# Altium project Graduate Work.PrjPcb
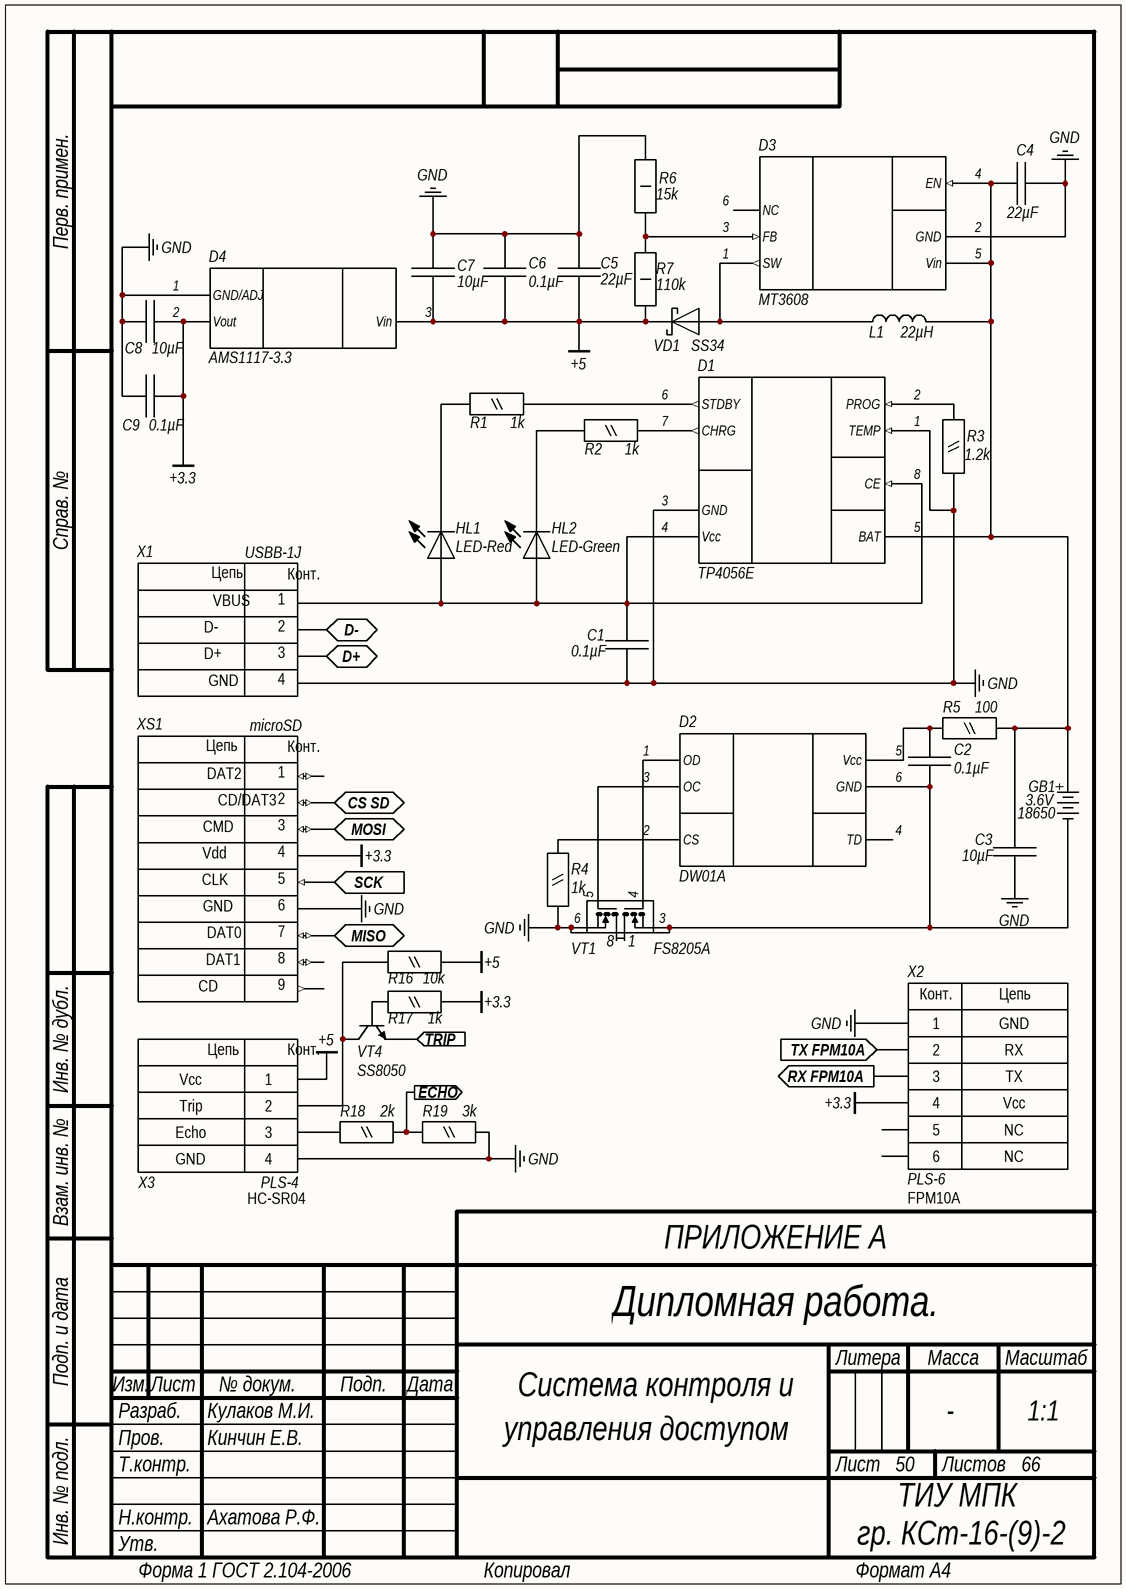
[diagram p0: Sheet1.SchDoc]

6 sheets, 88 parts. Net scope: flat (ports and power ports of the same name join across sheets).
Board file: PCB.PcbDoc
Sheets:
  Sheet1.SchDoc
  Sheet2.SchDoc
  Sheet3.SchDoc
  Sheet4.SchDoc
  Sheet5.SchDoc
  Sheet6.SchDoc

## Sheet Sheet1.SchDoc: =GlobalProjectName
size 209 x 297 mm; CheckedBy: Кинчин Е.В.; Author: Кулаков М.И.; DrawnBy: Кулаков М.; SheetNumber: 50; SheetTotal: 66; PageSetup: Record=PageOptions|CenterHorizontal=True|CenterVertical=True|PrintScale=1.00|XCorrection=1.00|YCorrection=1.00|PrintKind=1|BorderSize=5000000|LeftOffset=0|BottomOffset=0|Orientation=2|PaperLength=1000|PaperWidth=1000|Scale=100|PaperSource=15|PrintQuality=1200|MediaType=1|DitherType=10|PaperKind=A3|PrintScaleMode=1; Weight: -; ScaleFactor: 1:1; NormInspection: Ахатова Р.Ф.

### Parts
D1  TP4056E  [U SOIC-8]
D2  DW01A  [U SOT-23-6]
D3  MT3608  [U SOT-23-6]
D4  AMS1117-3.3  [U SOT-223]
GB1  3.6V  Case: 18650  [GB 18650]
HL1  LED-Red  [HL LED SMD 0805]
HL2  LED-Green  [HL LED SMD 0805]
L1  22µH  [L SMD D10]
R1  1k  [R SMD 0805]
R2  1k  [R SMD 0805]
R3  1.2k  [R SMD 0805]
R4  1k  [R SMD 0805]
R5  100  [R SMD 0805]
R6  15k  [R SMD 2512]
R7  110k  [R SMD 2512]
R16  10k  [R SMD 0805]
R17  1k  [R SMD 0805]
R18  2k  [R SMD 0805]
R19  3k  [R SMD 0805]
VD1  SS34  [VD DO-214AB]
VT1  FS8205A  [U TSSOP-8]
VT4  SS8050  [U SOT-23-3]
X1  USBB-1J  [X USBB-1J]
X2  PLS-6  CommentText: FPM10A  [X PLS-6]
X3  PLS-4  CommentText: HC-SR04  [X PLS-4]
XS1  microSD  [X microSD]
С1  0.1µF  [C SMD 0805]
С2  0.1µF  [C SMD 0805]
С3  10µF  [C SMD 0805]
С4  22µF  [C SMD 1206]
С5  22µF  [C SMD 1206]
С6  0.1µF  [C SMD 0805]
С7  10µF  [C SMD 0805]
С8  10µF  [C SMD 0805]
С9  0.1µF  [C SMD 0805]

### Ports
CS SD (bidir), D+ (bidir), D- (bidir), ECHO (out), MISO (bidir), MOSI (bidir), RX FPM10A (out), SCK (in), TRIP (in), TX FPM10A (in)

### Nets
+3.3: D4.2(Vout) R17.2 X2.4 XS1.4(Vdd) С8.2 С9.1
+5: D4.3(Vin) R7.2 R16.2 VD1.2 X3.1 С5.1 С6.1 С7.2
GND: D1.1(TEMP) D1.3(GND) D3.2(GND) D4.1(GND/ADJ) R3.1 R4.1 R6.2 R19.1 VT1.6(S2) VT1.7(S2) X1.4(GND) X2.1 X3.4 XS1.6(GND) С1.2 С3.2 С4.2 С5.2 С6.2 С7.1 С8.1 С9.2
NetD1_2: D1.2(PROG) R3.2
NetD1_4: D1.4(Vcc) D1.8(CE) HL1.1 HL2.1 X1.1(VBUS) С1.1
NetD1_5: D1.5(BAT) D3.4(EN) D3.5(Vin) GB1.2(+) L1.2 R5.2 С3.1 С4.1
NetD1_6: D1.6(STDBY) R1.2
NetD1_7: D1.7(CHRG) R2.2
NetD2_1: D2.1(OD) VT1.4(G1)
NetD2_2: D2.2(CS) R4.2
NetD2_3: D2.3(OC) VT1.5(G2)
NetD2_5: D2.5(Vcc) R5.1 С2.2
NetD2_6: D2.6(GND) GB1.1(-) VT1.2(S1) VT1.3(S1) С2.1
NetD3_1: D3.1(SW) L1.1 VD1.1
NetD3_3: D3.3(FB) R6.1 R7.1
NetD6_23: VT4.1(E) ; port TRIP
NetD6_26: R18.1 R19.2 ; port ECHO
NetD6_27: X2.3 ; port RX FPM10A
NetD6_28: X2.2 ; port TX FPM10A
NetD6_29: XS1.2(CD/DAT3) ; port CS SD
NetD6_30: XS1.5(CLK) ; port SCK
NetD6_31: XS1.7(DATA0) ; port MISO
NetD6_37: XS1.3(CMD) ; port MOSI
NetHL1_2: HL1.2 R1.1
NetHL2_2: HL2.2 R2.1
NetR16_1: R16.1 VT4.3(C) X3.2
NetR17_1: R17.1 VT4.2(B)
NetR18_2: R18.2 X3.3
NetU1_5: X1.3(D-) ; port D+
NetU1_6: X1.2(D-) ; port D-

Not connected (* = marked no-connect by the designer): D2 4(TD); D3 6(NC); VT1 1(D1) 8(D2); X2 5 6; XS1 1(DAT2) 8(DATA1)

### Notes on the sheet
- ПРИЛОЖЕНИЕ А
- Дипломная работа.
- Система контроля и
- управления доступом
- ТИУ МПК
  гр. КСт-16-(9)-2
- Перв. примен.
- Справ. №
- Инв. № дубл.
- Взам. инв. №
- Подп. и дата
- Разраб.
- Изм.
- Лист
- № докум.
- Подп.
- Дата
- Литера
- Масса
- Масштаб
- Пров.
- Т.контр.
- Листов
- Инв. № подл.
- Н.контр.
- Утв.
- Форма 1 ГОСТ 2.104-2006
- Копировал
- Формат А4
- (in symbol microSD) Цепь; Конт.; DAT0; DAT1; 9
- (in symbol PLS-4) Цепь; Конт.
- (in symbol PLS-6) Конт.; Цепь
- (in symbol USB B) Цепь; Конт.; D+

### Library data of the parts
D1 = TP4056: Контроллер зарядки батарейки.; Manufacturer: NanJing Top Power ASIC Corp.; Case: SOP-8; ComponentLink1Description: Datasheet; ComponentLink1URL: https://static.chipdip.ru/lib/977/DOC002977110.pdf; Model: TP4056E; ComponentLink2Description: Store; ComponentLink2URL: https://aliexpress.ru/item/32982194674.html?spm=a2g0s.9042311.0.0.75c333eday2Luc; ComponentLink3Description: HelpURL; ComponentLink3URL: *
D2 = DW01: Защита для литиевого аккумулятора.; Manufacturer: Shenzhen H&M Semiconductor Co. Ltd.; Case: SOT-23-6; ComponentLink1Description: Datasheet; ComponentLink1URL: http://hmsemi.com/downfile/DW01A.PDF; Model: DW01A; ComponentLink2Description: Store; ComponentLink2URL: https://aliexpress.ru/item/32984691553.html?spm=a2g0s.9042311.0.0.543133edCjZ4Pa; ComponentLink3Description: HelpURL; ComponentLink3URL: *
D3 = MT3608: Повышающий преобразователь.; Manufacturer: AEROSEMI; Case: SOT-23-6; Model: MT3608; ComponentLink1Description: HelpURL; ComponentLink1URL: *; ComponentLink2Description: Datasheet; ComponentLink2URL: https://prom-electric.ru/media/MT3608.pdf; ComponentLink3Description: Store; ComponentLink3URL: https://smdx.ru/mt3608-b628
D4 = AMS1117: Стабилизатор напряжения.; Manufacturer: Advanced Monolithic Systems; Voltage: 3.3; Model: AMS1117-3.3; ComponentLink1Description: Datasheet; ComponentLink1URL: http://www.advanced-monolithic.com/pdf/ds1117.pdf; Case: SOT-223; ComponentLink2Description: Store; ComponentLink2URL: https://aliexpress.ru/item/4000453803123.html?spm=a2g0s.9042311.0.0.543133edCjZ4Pa
GB1 = Батарея: Manufacturer: LG; Model: LGAAS31865; Capacity: 2200mAh; Voltage: 3.6V; ComponentLink1Description: Store; ComponentLink1URL: *; ComponentLink2Description: HelpURL; ComponentLink2URL: *; ComponentLink3Description: Datasheet; ComponentLink3URL: https://www.tme.eu/Document/851884e7c9339fa73b5bf66663baac51/ACCU-ICR18650-2.2.pdf
HL1 = Светодиод: Manufacturer: Taiwan Oasis Technology Co., Ltd; Color: Red; Case: 0805; Model: LED-Red; ComponentLink1Description: Datasheet; ComponentLink1URL: https://static.chipdip.ru/lib/736/DOC002736052.pdf; ComponentLink2Description: HelpURL; ComponentLink2URL: *; ComponentLink3Description: Store; ComponentLink3URL: https://www.chipdip.ru/product/to-2013bc-mre
HL2 = Светодиод: Manufacturer: Taiwan Oasis Technology Co., Ltd; Color: Green; Case: 0805; Model: LED-Green; ComponentLink1Description: Datasheet; ComponentLink1URL: https://static.chipdip.ru/lib/736/DOC002736052.pdf; ComponentLink2Description: HelpURL; ComponentLink2URL: *; ComponentLink3Description: Store; ComponentLink3URL: https://www.chipdip.ru/product/to-2013bc-mre
L1 = Катушка индуктивности: Manufacturer: Epcos; Model: B82464G4223M; ComponentLink1Description: HelpURL; ComponentLink1URL: *; ComponentLink2Description: Datasheet; ComponentLink2URL: https://static.chipdip.ru/lib/547/DOC005547906.pdf; ComponentLink3Description: Store; ComponentLink3URL: https://www.chipdip.ru/product/b82464g4223m; Case: SMD D10xH4.8; Value: 22µH
R1 R2 R4 R17 = Резистор 0.125 Вт: R; Model: RC0805JR-071KL; Power: 0.125; Case: 0805; Manufacturer: *; ComponentLink1Description: Datasheet; ComponentLink1URL: *; ComponentLink2Description: HelpURL; ComponentLink2URL: *; Value: 1k; ComponentLink3Description: Store; ComponentLink3URL: https://www.chipdip.ru/product0/843440046
R3 = Резистор 0.125 Вт: R; Model: RC0805FR-071K2L; Power: 0.125; Case: 0805; Manufacturer: *; ComponentLink1Description: Datasheet; ComponentLink1URL: *; ComponentLink2Description: HelpURL; ComponentLink2URL: *; Value: 1.2k; ComponentLink3Description: Store; ComponentLink3URL: https://www.chipdip.ru/product0/9000079488
R5 = Резистор 0.125 Вт: R; Model: RC0805FR-07100RL; Power: 0.125; Case: 0805; Manufacturer: *; ComponentLink1Description: Datasheet; ComponentLink1URL: *; ComponentLink2Description: HelpURL; ComponentLink2URL: *; Value: 100; ComponentLink3Description: Store; ComponentLink3URL: https://www.chipdip.ru/product0/9000079462
R6 = Резистор 1 Вт: R; Model: RC2512FR-0715KL; Power: 1; Case: 2512; Manufacturer: *; ComponentLink1Description: Datasheet; ComponentLink1URL: *; ComponentLink2Description: HelpURL; ComponentLink2URL: *; Value: 15k; ComponentLink3Description: Store; ComponentLink3URL: https://www.chipdip.ru/product0/9000190185
R7 = Резистор 1 Вт: R; Model: RC2512FR-07110KL; Power: 1; Case: 2512; Manufacturer: *; ComponentLink1Description: Datasheet; ComponentLink1URL: *; ComponentLink2Description: HelpURL; ComponentLink2URL: *; Value: 110k; ComponentLink3Description: Store; ComponentLink3URL: https://www.chipdip.ru/product0/9000190222
R16 = Резистор 0.125 Вт: R; Model: RC0805FR-0710KL; Power: 0.125; Case: 0805; Manufacturer: *; ComponentLink1Description: Datasheet; ComponentLink1URL: *; ComponentLink2Description: HelpURL; ComponentLink2URL: *; Value: 10k; ComponentLink3Description: Store; ComponentLink3URL: https://www.chipdip.ru/product0/9000079514
R18 = Резистор 0.125 Вт: R; Model: RC0805JR-072KL; Power: 0.125; Case: 0805; Manufacturer: *; ComponentLink1Description: Datasheet; ComponentLink1URL: *; ComponentLink2Description: HelpURL; ComponentLink2URL: *; Value: 2k; ComponentLink3Description: Store; ComponentLink3URL: https://www.chipdip.ru/product0/811944944
R19 = Резистор 0.125 Вт: R; Model: RC0805JR-073KL; Power: 0.125; Case: 0805; Manufacturer: *; ComponentLink1Description: Datasheet; ComponentLink1URL: *; ComponentLink2Description: HelpURL; ComponentLink2URL: *; Value: 3k; ComponentLink3Description: Store; ComponentLink3URL: https://www.chipdip.ru/product0/88534195
VD1 = Диод Шотки: Manufacturer: Vishay General Semiconductor; Case: SMC; Model: SS34; ComponentLink1Description: Datasheet; ComponentLink1URL: https://static.chipdip.ru/lib/501/DOC001501148.pdf; ComponentLink2Description: HelpURL; ComponentLink2URL: *; ComponentLink3Description: Store; ComponentLink3URL: https://www.chipdip.ru/product/ss34-5
VT1 = FS8205: Транзисторная сборка. Если корпус SOIC-8, то смотри подробное условное обозначение. Пины 2 и 5 находятся по середине, в внутренней схеме они соеденины.; Manufacturer: Fortune Semiconductor Corp.; Model: FS8205A; Case: TSSOP-8; ComponentLink1Description: Datasheet; ComponentLink1URL: https://www.ic-fortune.com/upload/Download/FS8205A-DS-12_EN.pdf; ComponentLink2Description: Detailed symbol; ComponentLink2URL: https://go-radio.ru/images/8205a.png; ComponentLink3Description: Store; ComponentLink3URL: https://aliexpress.ru/item/4000453813065.html?spm=a2g0s.9042311.0.0.75c333eday2Luc; ComponentLink4Description: HelpURL; ComponentLink4URL: *
VT4 = Биполярный Транзистор: Manufacturer: Hottech; Model: SS8050; Case: SOT-23-3; ComponentLink1Description: Datasheet; ComponentLink1URL: https://static.chipdip.ru/lib/210/DOC005210683.pdf; ComponentLink2Description: HelpURL; ComponentLink2URL: *; ComponentLink3Description: Store; ComponentLink3URL: https://www.chipdip.ru/product/ss8050-hottech
X1 = USB B: Manufacturer: Molex; TypeConnector: USB B; Model: USBB-1J; ComponentLink1Description: Store; ComponentLink1URL: https://www.chipdip.ru/product/usbb-1j-ds1099-b; ComponentLink2Description: Datasheet; ComponentLink2URL: *; ComponentLink3Description: HelpURL; ComponentLink3URL: *
X2 = PLS-6: Manufacturer: Connfly; TypeConnector: Connector; VoltageMax: 500VAC; Pitch: 2.54mm; CurrentMax: 3A; Multichannel: 6pin; Text6: NC; Text4: Vcc; Text3: TX; Text1: GND; Text2: RX; Model: PLS-6; ComponentLink1Description: Store; ComponentLink1URL: *; Text5: NC
X3 = PLS-4: Manufacturer: Connfly; TypeConnector: Connector; VoltageMax: 500VAC; Pitch: 2.54mm; CurrentMax: 3A; Multichannel: 4pin; Text4: GND; Text3: Echo; Text1: Vcc; Text2: Trip; Model: PLS-4; ComponentLink1Description: Store; ComponentLink1URL: https://aliexpress.ru/item/1872588324.html?spm=a2g0s.9042311.0.0.264d33edUHMLcH
XS1 = microSD: Слот для карты памяти.; Manufacturer: Molex; TypeConnector: microSD; Model: *; ComponentLink1Description: Store; ComponentLink1URL: https://aliexpress.ru/item/32802051702.html?spm=a2g0s.9042311.0.0.4d6533edTBBY1Q; ComponentLink2Description: Datasheet; ComponentLink2URL: *; ComponentLink3Description: HelpURL; ComponentLink3URL: https://kicad-info.s3-us-west-2.amazonaws.com/original/2X/8/8d1dbfabaa90b65dad4965a185d7e55230d35003.png
С1 = Конденсатор: C; Model: MLCC0.1uFY5V50V+80-20%0805; Voltage: 50; Case: 0805; Manufacturer: *; ComponentLink1Description: Datasheet; ComponentLink1URL: *; ComponentLink2Description: HelpURL; ComponentLink2URL: *; Value: 0.1µF; ComponentLink3Description: Store; ComponentLink3URL: https://www.chipdip.ru/product0/642412305
С2 С6 С9 = Конденсатор: Model: MLCC0.1uFY5V50V+80-20%0805; Voltage: 50; Case: 0805; Manufacturer: *; ComponentLink1Description: Datasheet; ComponentLink1URL: *; ComponentLink2Description: HelpURL; ComponentLink2URL: *; Value: 0.1µF; ComponentLink3Description: Store; ComponentLink3URL: https://www.chipdip.ru/product0/77059545
С3 С7 С8 = Конденсатор: C; Manufacturer: Murata Manufacturing; Model: GRM21BR61C106KE15L; Voltage: 16; Case: 0805; ComponentLink1Description: Datasheet; ComponentLink1URL: https://static.chipdip.ru/lib/428/DOC005428493.pdf; ComponentLink2Description: HelpURL; ComponentLink2URL: *; Value: 10µF; ComponentLink3Description: Store; ComponentLink3URL: https://www.chipdip.ru/product/grm21br61c106ke15l
С4 С5 = Конденсатор: Manufacturer: Murata Manufacturing; Model: GRM31CR61C226KE15L; Voltage: 16; Case: 1206; ComponentLink1Description: Datasheet; ComponentLink2Description: HelpURL; ComponentLink2URL: *; Value: 22µF; ComponentLink3Description: Store
  С4: ComponentLink1URL: https://static.chipdip.ru/lib/428/DOC005428493.pdf; ComponentLink3URL: https://www.chipdip.ru/product/grm31cr61c226ke15l
  С5: ComponentLink1URL: *; ComponentLink3URL: *

## Sheet Sheet2.SchDoc: =GlobalProjectName
size 209 x 297 mm; ApprovedBy: Утвердил; CheckedBy: Проверил; Author: Разработал; SheetNumber: 51; SheetTotal: 66; PageSetup: Record=PageOptions|CenterHorizontal=True|CenterVertical=True|PrintScale=1.00|XCorrection=1.00|YCorrection=1.00|PrintKind=1|BorderSize=5000000|LeftOffset=0|BottomOffset=0|Orientation=2|PaperLength=1000|PaperWidth=1000|Scale=100|PaperSource=15|PrintQuality=1200|MediaType=1|DitherType=10|PaperKind=A3|PrintScaleMode=1; Weight: -; ScaleFactor: -; NormInspection: Норм.Контр.
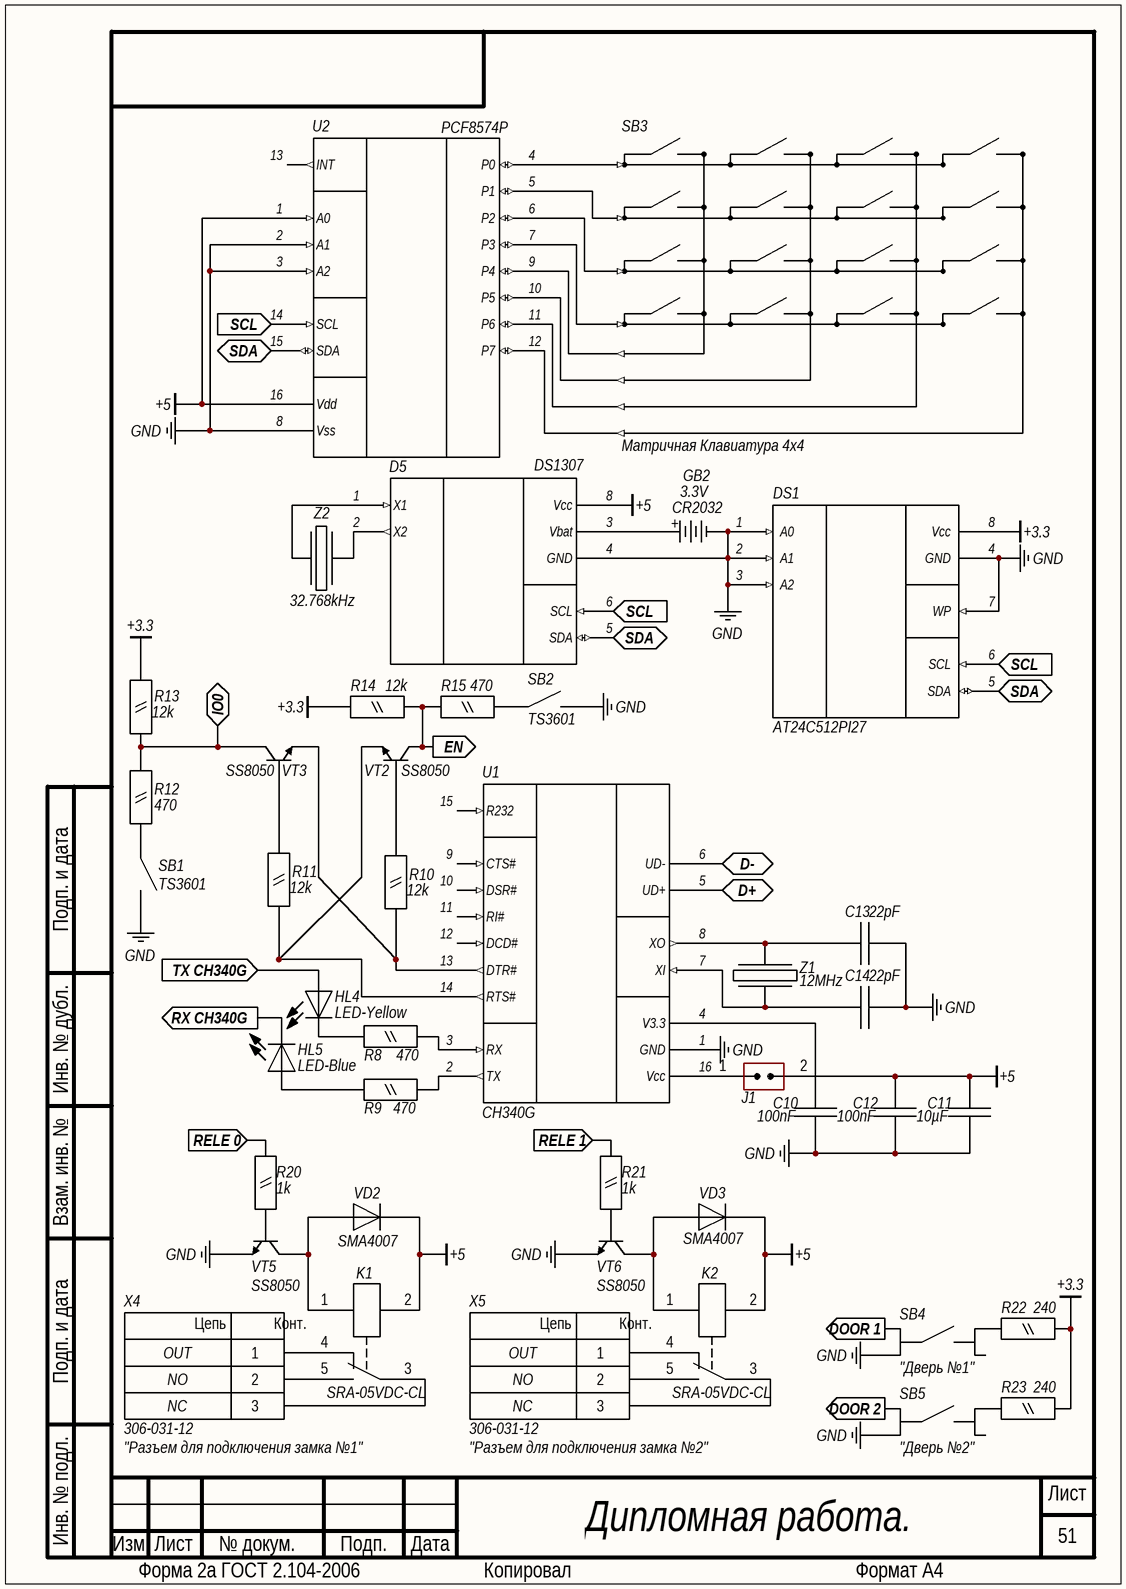
[diagram p1: Sheet2.SchDoc]

### Parts
D5  DS1307  [U DIP-8]
DS1  AT24C512PI27  [U DIP-8]
GB2  3.3V  Case: CR2032  [GB CR2032]
HL4  LED-Yellow  [HL LED SMD 0805]
HL5  LED-Blue  [HL LED SMD 0805]
J1  (no value)  [CON: PLS-2]
K1  SRA-05VDC-CL  [K SRA-05VDC-CL]
K2  SRA-05VDC-CL  [K SRA-05VDC-CL]
R8  470  [R SMD 0805]
R9  470  [R SMD 0805]
R10  12k  [R SMD 0805]
R11  12k  [R SMD 0805]
R12  470  [R SMD 0805]
R13  12k  [R SMD 0805]
R14  12k  [R SMD 0805]
R15  470  [R SMD 0805]
R20  1k  [R SMD 0805]
R21  1k  [R SMD 0805]
R22  240  [R SMD 0805]
R23  240  [R SMD 0805]
SB1  TS3601  [SB 3.5x6]
SB2  TS3601  [SB 3.5x6]
SB3  Матричная Клавиатура 4x4  [X PLS-8]
SB4  "Дверь №1"  [X 301-031-12]
SB5  "Дверь №2"  [X 301-031-12]
U1  CH340G  [U SOIC-16]
U2  PCF8574P  [U DIP-16]
VD2  SMA4007  [VD DO-214AC]
VD3  SMA4007  [VD DO-214AC]
VT2  SS8050  [U SOT-23-3]
VT3  SS8050  [U SOT-23-3]
VT5  SS8050  [U SOT-23-3]
VT6  SS8050  [U SOT-23-3]
X4  306-031-12  CommentText: "Разъем для подключения замка №1"  [X 301-031-12]
X5  306-031-12  CommentText: "Разъем для подключения замка №2"  [X 301-031-12]
Z1  12MHz  [Z HC-49]
Z2  32.768kHz  [Z DT-26]
С10  100nF  [C SMD 0805]
С11  10µF  [C SMD 0805]
С12  100nF  [C SMD 0805]
С13  22pF  [C SMD 0805]
С14  22pF  [C SMD 0805]

### Ports
D+ (bidir), D- (bidir), DOOR 1 (out), DOOR 2 (out), EN (out), IO0 (bidir), RELE 0 (in), RELE 1 (in), RX CH340G (out), SCL (in), SDA (bidir), TX CH340G (in)

### Nets
+3.3: DS1.8(Vcc) R13.2 R14.2 R22.2 R23.2
+5: D5.8(Vcc) J1.2(IN) K1.2 K2.2 U2.1(A0) U2.16(Vdd) VD2.2 VD3.2 С11.2 С12.2
GND: D5.4(GND) DS1.1(A0) DS1.2(A1) DS1.3(A2) DS1.4(GND) DS1.7(WP) GB2.1(-) SB1.2 SB2.2 SB4.2 SB5.2 U1.1(GND) U2.2(A1) U2.3(A2) U2.8(Vss) VT5.1(E) VT6.1(E) С10.1 С11.1 С12.1 С13.2 С14.2
NetD5_1: D5.1(X1) Z2.2
NetD5_2: D5.2(X2) Z2.1
NetD5_3: D5.3(Vbat) GB2.2(+)
NetD5_5: D5.5(SDA) DS1.5(SDA) U2.15(SDA) ; port SDA
NetD5_6: D5.6(SCL) DS1.6(SCL) U2.14(SCL) ; port SCL
NetD6_3: R14.1 R15.1 VT2.3(C) ; port EN
NetD6_10: R21.1 ; port RELE 1
NetD6_11: R20.1 ; port RELE 0
NetD6_14: SB5.1 ; port DOOR 2
NetD6_16: SB4.1 ; port DOOR 1
NetD6_25: R12.1 R13.1 VT3.3(C) ; port IO0
NetD6_34: HL5.2 ; port RX CH340G
NetD6_35: HL4.1 ; port TX CH340G
NetHL4_2: HL4.2 R8.1
NetHL5_1: HL5.1 R9.1
NetJ1_1: J1.1(IN) U1.16(Vcc)
NetK1_1: K1.1 VD2.1 VT5.3(C)
NetK1_3: K1.3 X4.3
NetK1_4: K1.4 X4.1
NetK1_5: K1.5 X4.2
NetK2_1: K2.1 VD3.1 VT6.3(C)
NetK2_3: K2.3 X5.3
NetK2_4: K2.4 X5.1
NetK2_5: K2.5 X5.2
NetR8_2: R8.2 U1.3(RX)
NetR9_2: R9.2 U1.2(TX)
NetR10_1: R10.1 U1.13(DTR#) VT3.1(E)
NetR10_2: R10.2 VT2.2(B)
NetR11_1: R11.1 U1.14(RTS#) VT2.1(E)
NetR11_2: R11.2 VT3.2(B)
NetR12_2: R12.2 SB1.1
NetR15_2: R15.2 SB2.1
NetR20_2: R20.2 VT5.2(B)
NetR21_2: R21.2 VT6.2(B)
NetR22_1: R22.1 SB4.3
NetR23_1: R23.1 SB5.3
NetSB3_1: SB3.1 U2.4(P0)
NetSB3_2: SB3.2 U2.5(P1)
NetSB3_3: SB3.3 U2.6(P2)
NetSB3_4: SB3.4 U2.7(P3)
NetSB3_5: SB3.5 U2.9(P4)
NetSB3_6: SB3.6 U2.10(P5)
NetSB3_7: SB3.7 U2.11(P6)
NetSB3_8: SB3.8 U2.12(P7)
NetU1_4: U1.4(V3.3) С10.2
NetU1_5: U1.5(UD+) ; port D+
NetU1_6: U1.6(UD-) ; port D-
NetU1_7: U1.7(XI) Z1.1 С14.1
NetU1_8: U1.8(XO) Z1.2 С13.1

Not connected (* = marked no-connect by the designer): SB4 4; SB5 4; U1 9(CTS#) 10(DSR#) 11(RI#) 12(DCD#) 15(R232); U2 13(INT)

### Notes on the sheet
- Дипломная работа.
- Подп. и дата
- Инв. № дубл.
- Взам. инв. №
- Инв. № подл.
- Изм.
- Лист
- № докум.
- Подп.
- Дата
- Форма 2а ГОСТ 2.104-2006
- Копировал
- Формат А4
- (in symbol Винтовой Клеммник 3 Pin) Цепь; Конт.

### Library data of the parts
D5 = DS1307: Часы реального времени.; Manufacturer: Dallas Semiconductor; ComponentLink1Description: HelpURL; ComponentLink1URL: *; ComponentLink2Description: Datasheet; ComponentLink2URL: https://www.sparkfun.com/datasheets/Components/DS1307.pdf; Case: *; Model: DS1307; ComponentLink3Description: Store; ComponentLink3URL: https://aliexpress.ru/item/33022793738.html?spm=a2g0s.9042311.0.0.4d6533edTBBY1Q
DS1 = AT24C: Перезаписываемая постоянная память.; Manufacturer: Atmel; Device Revision: B; Memory Size: 512 kbit; Case: PDIP-8; Model: AT24C512PI27; ComponentLink1Description: Datasheet; ComponentLink1URL: http://ww1.microchip.com/downloads/en/devicedoc/atmel-8720-seeprom-at24c512c-datasheet.pdf; ComponentLink2Description: HelpURL; ComponentLink2URL: https://www.microchip.com/wwwproducts/en/AT24C512C; ComponentLink3Description: Store; ComponentLink3URL: https://aliexpress.ru/item/32598383117.html?spm=a2g0s.9042311.0.0.3da233edDDspR7
GB2 = Батарея: Voltage: 3.3V; Model: *; Manufacturer: *; Capacity: *; ComponentLink1Description: Store; ComponentLink1URL: *; ComponentLink2Description: HelpURL; ComponentLink2URL: *; ComponentLink3Description: Datasheet; ComponentLink3URL: *
HL4 = Светодиод: Manufacturer: Taiwan Oasis Technology Co., Ltd; Color: Yellow; Case: 0805; Model: LED-Yellow; ComponentLink1Description: Datasheet; ComponentLink1URL: https://static.chipdip.ru/lib/736/DOC002736052.pdf; ComponentLink2Description: HelpURL; ComponentLink2URL: *; ComponentLink3Description: Store; ComponentLink3URL: https://www.chipdip.ru/product/to-2013bc-myf
HL5 = Светодиод: Manufacturer: Taiwan Oasis Technology Co., Ltd; Color: Blue; Case: 0805; Model: LED-Blue; ComponentLink1Description: Datasheet; ComponentLink1URL: https://static.chipdip.ru/lib/736/DOC002736052.pdf; ComponentLink2Description: HelpURL; ComponentLink2URL: *; ComponentLink3Description: Store; ComponentLink3URL: https://www.chipdip.ru/product/to-2013bc-bf
J1 = Jumper_single: CommentText: "Перемычка"
K1 K2 = Реле SRD-05VDC: Manufacturer: Ningbo Songle; TypeRelay: Electromechanics relay; VoltageMax: 250VAC; VoltageControlCoil: 5VDC; MaxCurrent: 20A; Temperature: -40...+85°C; Model: SRA-05VDC-CL; ComponentLink1Description: Store; ComponentLink1URL: https://aliexpress.ru/item/32836198919.html?spm=a2g0s.9042311.0.0.4d6533edTBBY1Q; ComponentLink2Description: Datasheet; ComponentLink2URL: https://www.circuitbasics.com/wp-content/uploads/2015/11/SRD-05VDC-SL-C-Datasheet.pdf; ComponentLink3Description: HelpURL; ComponentLink3URL: *
R8 R9 R12 R15 = Резистор 0.125 Вт: R; Model: RC0805FR-07470RL; Power: 0.125; Case: 0805; Manufacturer: *; ComponentLink1Description: Datasheet; ComponentLink1URL: *; ComponentLink2Description: HelpURL; ComponentLink2URL: *; Value: 470; ComponentLink3Description: Store; ComponentLink3URL: https://www.chipdip.ru/product0/9000079478
R10 R11 R13 R14 = Резистор 0.125 Вт: R; Model: RC0805FR-0712KL; Power: 0.125; Case: 0805; Manufacturer: *; ComponentLink1Description: Datasheet; ComponentLink1URL: *; ComponentLink2Description: HelpURL; ComponentLink2URL: *; Value: 12k; ComponentLink3Description: Store; ComponentLink3URL: https://www.chipdip.ru/product0/9000079516
R20 R21 = Резистор 0.125 Вт: R; Model: RC0805FR-071KL; Power: 0.125; Case: 0805; Manufacturer: *; ComponentLink1Description: Datasheet; ComponentLink1URL: *; ComponentLink2Description: HelpURL; ComponentLink2URL: *; Value: 1k; ComponentLink3Description: Store; ComponentLink3URL: https://www.chipdip.ru/product0/9000079486
R22 R23 = Резистор 0.125 Вт: R; Model: RC0805JR-07240RL; Power: 0.125; Case: 0805; Manufacturer: *; ComponentLink1Description: Datasheet; ComponentLink1URL: *; ComponentLink2Description: HelpURL; ComponentLink2URL: *; Value: 240; ComponentLink3Description: Store; ComponentLink3URL: https://www.chipdip.ru/product0/834986419
SB1 SB2 = Кнопка: Manufacturer: KLS electronic co ltd; ComponentLink1Description: Store; ComponentLink1URL: https://www.chipdip.ru/product/kls7-ts3601-4.3-180-tc-0120; ComponentLink2Description: Datasheet; ComponentLink2URL: https://static.chipdip.ru/lib/551/DOC001551910.pdf; ComponentLink3Description: HelpURL; ComponentLink3URL: *; Model: TS3601; Size: 3.5x6x4.3
SB3 = Матричная Клавиатура 4x4: SB; ComponentLink1Description: Store; ComponentLink1URL: https://aliexpress.ru/item/32874565775.html?spm=a2g0s.9042311.0.0.264d33edwiJORy
SB4 SB5 = Кнопка (2-х парная): SB; ComponentLink1Description: Store; ComponentLink1URL: *; ComponentLink2Description: Datasheet; ComponentLink2URL: *; ComponentLink3Description: HelpURL; ComponentLink3URL: *; Model: *; Size: *; Manufacturer: *
U1 = CH340G: Преобразователя интерфейса USB в UART.; Manufacturer: Nanjing Qinheng Microelectronics Co. Ltd.; Case: SOP-16; Model: CH340G; ComponentLink1Description: HelpURL; ComponentLink1URL: http://mypractic.ru/mikrosxema-ch340g-preobrazovatel-interfejsa-usb-v-uart-most-usb-uart-xarakteristiki-usloviya-ekspluatacii-tipovye-sxemy-vklyucheniya.html; ComponentLink2Description: Datasheet; ComponentLink2URL: http://www.wch-ic.com/products/CH340.html?from=search&q=eyJpdiI6InNwMEdrWnhCbzlTczZhZUM2cncxVHc9PSIsInZhbHVlIjoia0FTMDlncDFNZ29zQmJ2ZGJZOTBCZz09IiwibWFjIjoiZGE4NTAzZGQ0ZWQzNzFmMTZkZWFhMWYwOTExNzExNWI5YjhlMzUwMjE3NzYxMzc5MWI2ZmFmZTVlMDQ3ZDAwZiJ9; ComponentLink3Description: Store; ComponentLink3URL: https://aliexpress.ru/item/32836074859.html?spm=a2g0s.9042311.0.0.264d33edvcXNXs
U2 = PCF8574: IIC расширитель.; Model: PCF8574P; Manufacturer: *; Case: *; ComponentLink1Description: Datasheet №1; ComponentLink1URL: https://www.nxp.com/docs/en/data-sheet/PCF8574_PCF8574A.pdf; ComponentLink2Description: Datasheet №2; ComponentLink2URL: http://www.ti.com/lit/ds/symlink/pcf8574.pdf; ComponentLink3Description: HelpURL; ComponentLink3URL: *; ComponentLink4Description: Store; ComponentLink4URL: https://aliexpress.ru/item/4000480743714.html?spm=a2g0s.9042311.0.0.264d33edUHMLcH
VD2 VD3 = Диод: VD; Case: SMA; Manufacturer: *; Model: SMA4007; ComponentLink1Description: Datasheet; ComponentLink1URL: *; ComponentLink2Description: HelpURL; ComponentLink2URL: *; ComponentLink3Description: Store; ComponentLink3URL: https://www.chipdip.ru/product/sma4007
VT2 VT3 VT5 VT6 = Биполярный Транзистор: Manufacturer: Hottech; Model: SS8050; Case: SOT-23-3; ComponentLink1Description: Datasheet; ComponentLink1URL: https://static.chipdip.ru/lib/210/DOC005210683.pdf; ComponentLink2Description: HelpURL; ComponentLink2URL: *; ComponentLink3Description: Store; ComponentLink3URL: https://www.chipdip.ru/product/ss8050-hottech
X4 X5 = Винтовой Клеммник 3 Pin: TypeConnector: Terminal connector; VoltageMax: 300VAC; Pitch: 3.5mm; CurrentMax: 10A; Multichannel: 3pin; Text3: NC; Text2: NO; Text1: OUT; Manufacturer: *; Model: 306-031-12
Z1 = Кварцевый Резонатор: Model: HC-49; Case: *; Manufacturer: *; Frequency: 12MHz; ComponentLink1Description: Store; ComponentLink1URL: https://aliexpress.ru/item/32905911610.html?spm=a2g0s.9042311.0.0.264d33edzA8MIe; ComponentLink2Description: Datasheet; ComponentLink2URL: *; ComponentLink3Description: HelpURL; ComponentLink3URL: *
Z2 = Кварцевый Резонатор: Case: DT-26; Model: *; Manufacturer: *; Frequency: 32.768kHz; ComponentLink1Description: Store; ComponentLink1URL: https://www.chipdip.ru/product/32768hz-2x6mm; ComponentLink2Description: Datasheet; ComponentLink2URL: *; ComponentLink3Description: HelpURL; ComponentLink3URL: *
С10 С12 = Конденсатор: Manufacturer: Murata Manufacturing; Model: GRM21BR71E104KA01L; Voltage: 25; Case: 0805; ComponentLink1Description: Datasheet; ComponentLink1URL: https://static.chipdip.ru/lib/428/DOC005428493.pdf; ComponentLink2Description: HelpURL; ComponentLink2URL: *; Value: 100nF; ComponentLink3Description: Store; ComponentLink3URL: https://www.chipdip.ru/product/grm21br71e104ka01l
С11 = Конденсатор: as С3 on sheet Sheet1; Case: 0805; ComponentLink1Description: Datasheet; ComponentLink1URL: https://static.chipdip.ru/lib/428/DOC005428493.pdf; ComponentLink2Description: HelpURL; ComponentLink2URL: *; Value: 10µF; ComponentLink3Description: Store; ComponentLink3URL: https://www.chipdip.ru/product/grm21br61c106ke15l
С13 С14 = Конденсатор: Model: MLCC22pFNPO50V5%0805; Voltage: 50; Case: 0805; Manufacturer: *; ComponentLink1Description: Datasheet; ComponentLink1URL: *; ComponentLink2Description: HelpURL; ComponentLink2URL: *; Value: 22pF; ComponentLink3Description: Store; ComponentLink3URL: https://www.chipdip.ru/product0/29844

## Sheet Sheet3.SchDoc: =GlobalProjectName
size 209 x 297 mm; ApprovedBy: Утвердил; CheckedBy: Проверил; Author: Разработал; SheetNumber: 52; SheetTotal: 66; PageSetup: Record=PageOptions|CenterHorizontal=True|CenterVertical=True|PrintScale=1.00|XCorrection=1.00|YCorrection=1.00|PrintKind=1|BorderSize=5000000|LeftOffset=0|BottomOffset=0|Orientation=2|PaperLength=1000|PaperWidth=1000|Scale=100|PaperSource=15|PrintQuality=1200|MediaType=1|DitherType=10|PaperKind=A3|PrintScaleMode=1; Weight: -; ScaleFactor: -; NormInspection: Норм.Контр.
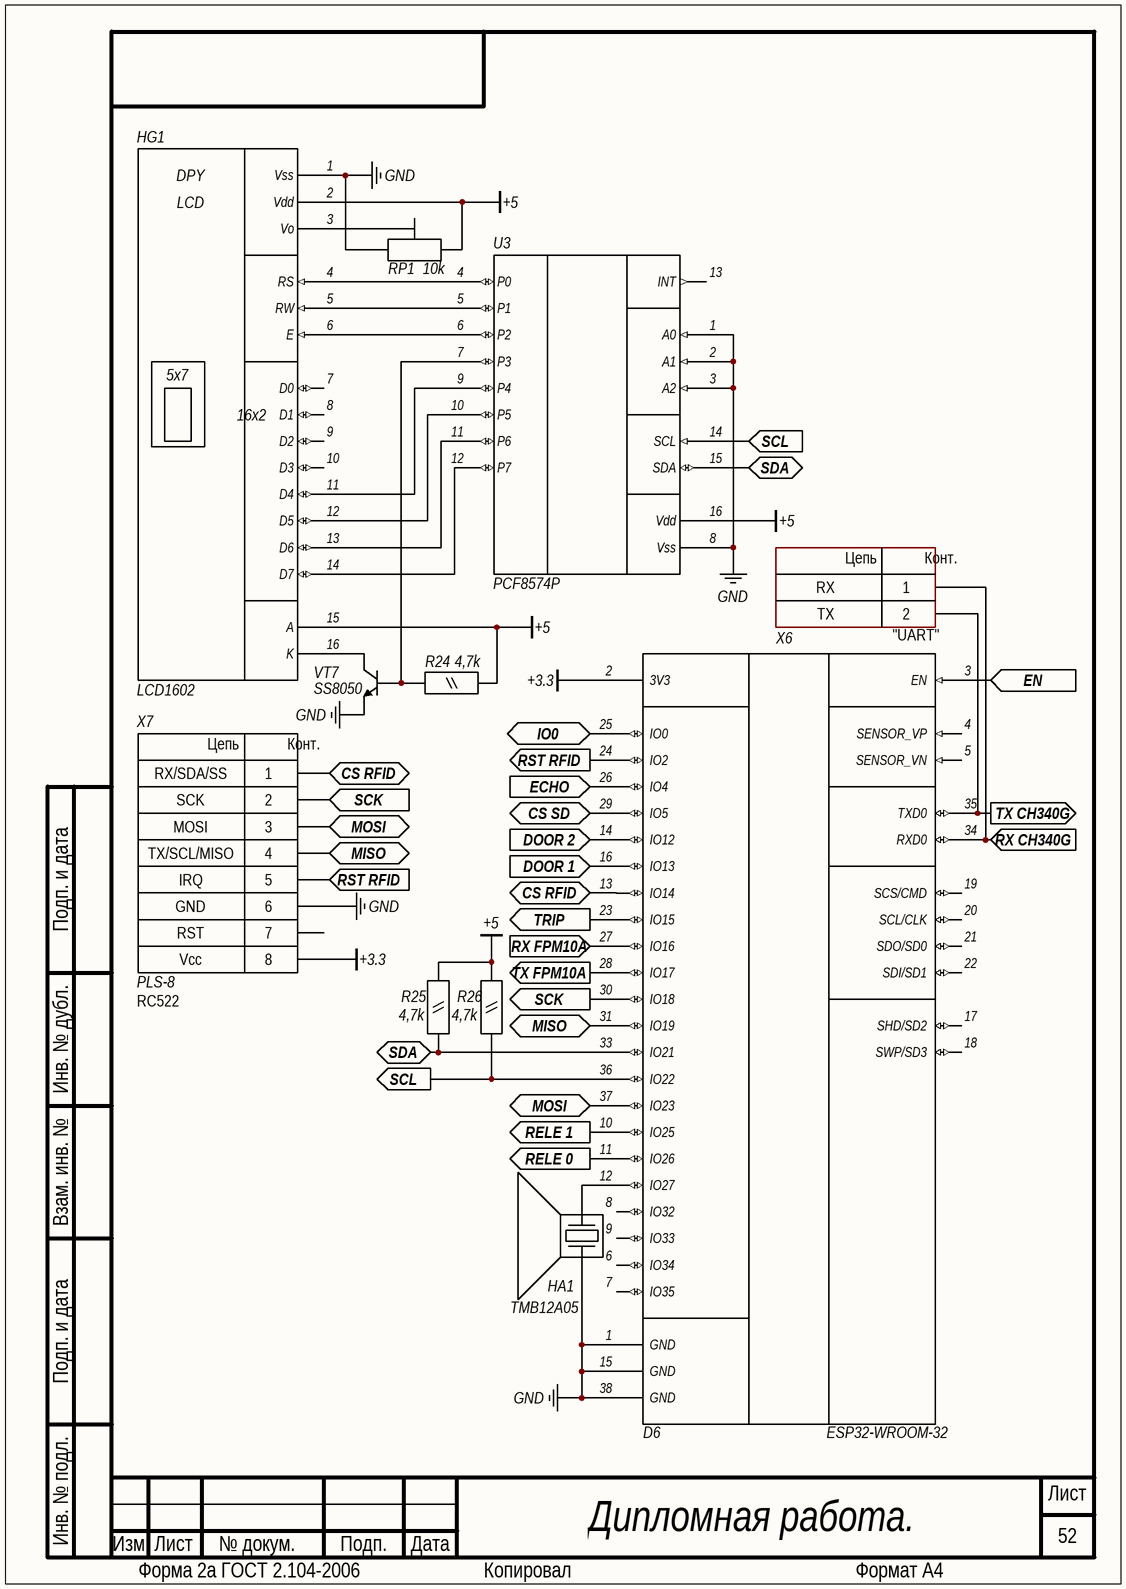
[diagram p2: Sheet3.SchDoc]

### Parts
D6  ESP32-WROOM-32  [D ESP-WROOOM-32]
HA1  TMB12A05  [HA TMB12A05]
HG1  LCD1602  [X PBS-16]
R24  4,7k  [R SMD 0805]
R25  4,7k  [R SMD 0805]
R26  4,7k  [R SMD 0805]
RP1  10k  [R ADJ-3296W]
U3  PCF8574P  [U DIP-16]
VT7  SS8050  [U SOT-23-3]
X6  CommentText: "UART"  Text1: RX  Text2: TX  [CON: PLS-2]
X7  PLS-8  CommentText: RC522  [X PLS-8]

### Ports
CS RFID (bidir), CS SD (bidir), DOOR 1 (in), DOOR 2 (in), ECHO (in), EN (in), IO0 (bidir), MISO (bidir), MOSI (bidir), RELE 0 (out), RELE 1 (out), RST RFID (in), RST RFID (out), RX CH340G (in), RX FPM10A (in), SCK (in), SCK (out), SCL (in), SCL (out), SDA (bidir), TRIP (out), TX CH340G (out), TX FPM10A (out)

### Nets
+3.3: D6.2(3V3) X7.8
+5: HG1.2(Vdd) HG1.15(A) R24.1 R25.1 R26.1 RP1.1 U3.16(Vdd)
GND: D6.1(GND) D6.15(GND) D6.38(GND) HA1.2(-) HG1.1(Vss) RP1.3 U3.1(A0) U3.2(A1) U3.3(A2) U3.8(Vss) VT7.1(E) X7.6
NetD5_5: D6.33(IO21) R25.2 U3.15(SDA) ; port SDA
NetD5_6: D6.36(IO22) R26.2 U3.14(SCL) ; port SCL
NetD6_3: D6.3(EN) ; port EN
NetD6_10: D6.10(IO25) ; port RELE 1
NetD6_11: D6.11(IO26) ; port RELE 0
NetD6_12: D6.12(IO27) HA1.1(+)
NetD6_13: D6.13(IO14) X7.1 ; port CS RFID
NetD6_14: D6.14(IO12) ; port DOOR 2
NetD6_16: D6.16(IO13) ; port DOOR 1
NetD6_23: D6.23(IO15) ; port TRIP
NetD6_24: D6.24(IO2) X7.5 ; port RST RFID
NetD6_25: D6.25(IO0) ; port IO0
NetD6_26: D6.26(IO4) ; port ECHO
NetD6_27: D6.27(IO16) ; port RX FPM10A
NetD6_28: D6.28(IO17) ; port TX FPM10A
NetD6_29: D6.29(IO5) ; port CS SD
NetD6_30: D6.30(IO18) X7.2 ; port SCK
NetD6_31: D6.31(IO19) X7.4 ; port MISO
NetD6_34: D6.34(RXD0) X6.1 ; port RX CH340G
NetD6_35: D6.35(TXD0) X6.2 ; port TX CH340G
NetD6_37: D6.37(IO23) X7.3 ; port MOSI
NetHG1_3: HG1.3(Vo) RP1.2
NetHG1_4: HG1.4(RS) U3.4(P0)
NetHG1_5: HG1.5(RW) U3.5(P1)
NetHG1_6: HG1.6(E) U3.6(P2)
NetHG1_11: HG1.11(D4) U3.9(P4)
NetHG1_12: HG1.12(D5) U3.10(P5)
NetHG1_13: HG1.13(D6) U3.11(P6)
NetHG1_14: HG1.14(D7) U3.12(P7)
NetHG1_16: HG1.16(K) VT7.3(C)
NetR24_2: R24.2 U3.7(P3) VT7.2(B)

Not connected (* = marked no-connect by the designer): D6 4(SENSOR_VP) 5(SENSOR_VN) 6(IO34) 7(IO35) 8(IO32) 9(IO33) 17(SHD/SD2) 18(SWP/SD3) 19(SCS/CMD) 20(SCL/CLK) 21(SDO/SD0) 22(SDI/SD1); HG1 7(D0) 8(D1) 9(D2) 10(D3); U3 13(INT); X7 7

### Notes on the sheet
- Дипломная работа.
- Подп. и дата
- Инв. № дубл.
- Взам. инв. №
- Инв. № подл.
- Изм.
- Лист
- № докум.
- Подп.
- Дата
- Форма 2а ГОСТ 2.104-2006
- Копировал
- Формат А4
- (in symbol LCD HD44780) DPY
- (in symbol PLS-2) Цепь; Конт.
- (in symbol PLS/PBS-8) Цепь; Конт.

### Library data of the parts
D6 = ESP32-WROOM: Manufacturer: Espressif Systems; Model: ESP32-WROOM-32; ComponentLink1Description: Datasheet; ComponentLink1URL: https://www.espressif.com/sites/default/files/documentation/esp32-wroom-32_datasheet_en.pdf; ComponentLink2Description: Store; ComponentLink2URL: https://aliexpress.ru/item/32921866832.html?spm=a2g0s.9042311.0.0.264d33edwiJORy; ComponentLink3Description: HelpURL; ComponentLink3URL: *
HA1 = Пьездодинамик: Model: TMB12A05; Manufacturer: *; Diameter: *; Voltage: *; ComponentLink1Description: Datasheet; ComponentLink1URL: *; ComponentLink2Description: Store; ComponentLink2URL: *
HG1 = LCD HD44780: Дисплей на основе контроллера HD44780.; ScreenResolution: 16x2; CharacterResolution: 5x7; Model: LCD1602; Manufacturer: *; Type: LCD; ComponentLink1Description: Store; ComponentLink1URL: *; ComponentLink2Description: Datasheet; ComponentLink2URL: *; ComponentLink3Description: HelpURL; ComponentLink3URL: *
R24-R26 = Резистор 0.125 Вт: R; Model: RC0805FR-074K7L; Power: 0.125; Case: 0805; Manufacturer: *; ComponentLink1Description: Datasheet; ComponentLink1URL: *; ComponentLink2Description: HelpURL; ComponentLink2URL: *; Value: 4,7k; ComponentLink3Description: Store; ComponentLink3URL: https://www.chipdip.ru/product0/9000079502
RP1 = Подстроечный Резистор: Case: *; Manufacturer: *; Model: *; ComponentLink1Description: Datasheet; ComponentLink1URL: *; ComponentLink2Description: HelpURL; ComponentLink2URL: *; Value: 10k; Power: *; ComponentLink3Description: Store; ComponentLink3URL: *
U3 = PCF8574: IIC расширитель.; Model: PCF8574P; Manufacturer: *; Case: *; ComponentLink1Description: Datasheet №1; ComponentLink1URL: https://www.nxp.com/docs/en/data-sheet/PCF8574_PCF8574A.pdf; ComponentLink2Description: Datasheet №2; ComponentLink2URL: http://www.ti.com/lit/ds/symlink/pcf8574.pdf; ComponentLink3Description: HelpURL; ComponentLink3URL: *; ComponentLink4Description: Store; ComponentLink4URL: https://aliexpress.ru/item/4000480743714.html?spm=a2g0s.9042311.0.0.264d33edUHMLcH
VT7 = Биполярный Транзистор: Manufacturer: Hottech; Model: SS8050; Case: SOT-23-3; ComponentLink1Description: Datasheet; ComponentLink1URL: https://static.chipdip.ru/lib/210/DOC005210683.pdf; ComponentLink2Description: HelpURL; ComponentLink2URL: *; ComponentLink3Description: Store; ComponentLink3URL: https://www.chipdip.ru/product/ss8050-hottech
X6 = PLS-2: Manufacturer: Connfly; ValueManufacturerPartNumber: Connector, 2pin, 2.54mm, 500VAC, 3A; TypeConnector: Connector; VoltageMax: 500VAC; Pitch: 2.54mm; CurrentMax: 3A; Multichannel: 2pin; HelpURL: https://www.chipdip.ru/product/pls-2; PartNumber: PLS-2
X7 = PLS/PBS-8: TypeConnector: Connector; VoltageMax: 500VAC; Pitch: 2.54mm; CurrentMax: 3A; Multichannel: 8pin; Text8: Vcc; Text7: RST; Text6: GND; Text5: IRQ; Text4: TX/SCL/MISO; Text3: MOSI; Text2: SCK; Text1: RX/SDA/SS; Manufacturer: *; Model: PLS-8; ComponentLink1Description: Store; ComponentLink1URL: https://aliexpress.ru/item/33014153324.html?spm=a2g0s.9042311.0.0.264d33edMcVqDH

## Sheet Sheet4.SchDoc: =GlobalProjectName
size 209 x 297 mm; ApprovedBy: Утвердил; CheckedBy: Проверил; Author: Разработал; SheetNumber: 53; SheetTotal: 66; PageSetup: Record=PageOptions|CenterHorizontal=True|CenterVertical=True|PrintScale=1.00|XCorrection=1.00|YCorrection=1.00|PrintKind=1|BorderSize=5000000|LeftOffset=0|BottomOffset=0|Orientation=2|PaperLength=1000|PaperWidth=1000|Scale=100|PaperSource=15|PrintQuality=1200|MediaType=1|DitherType=10|PaperKind=A3|PrintScaleMode=1; Weight: -; ScaleFactor: -; NormInspection: Норм.Контр.
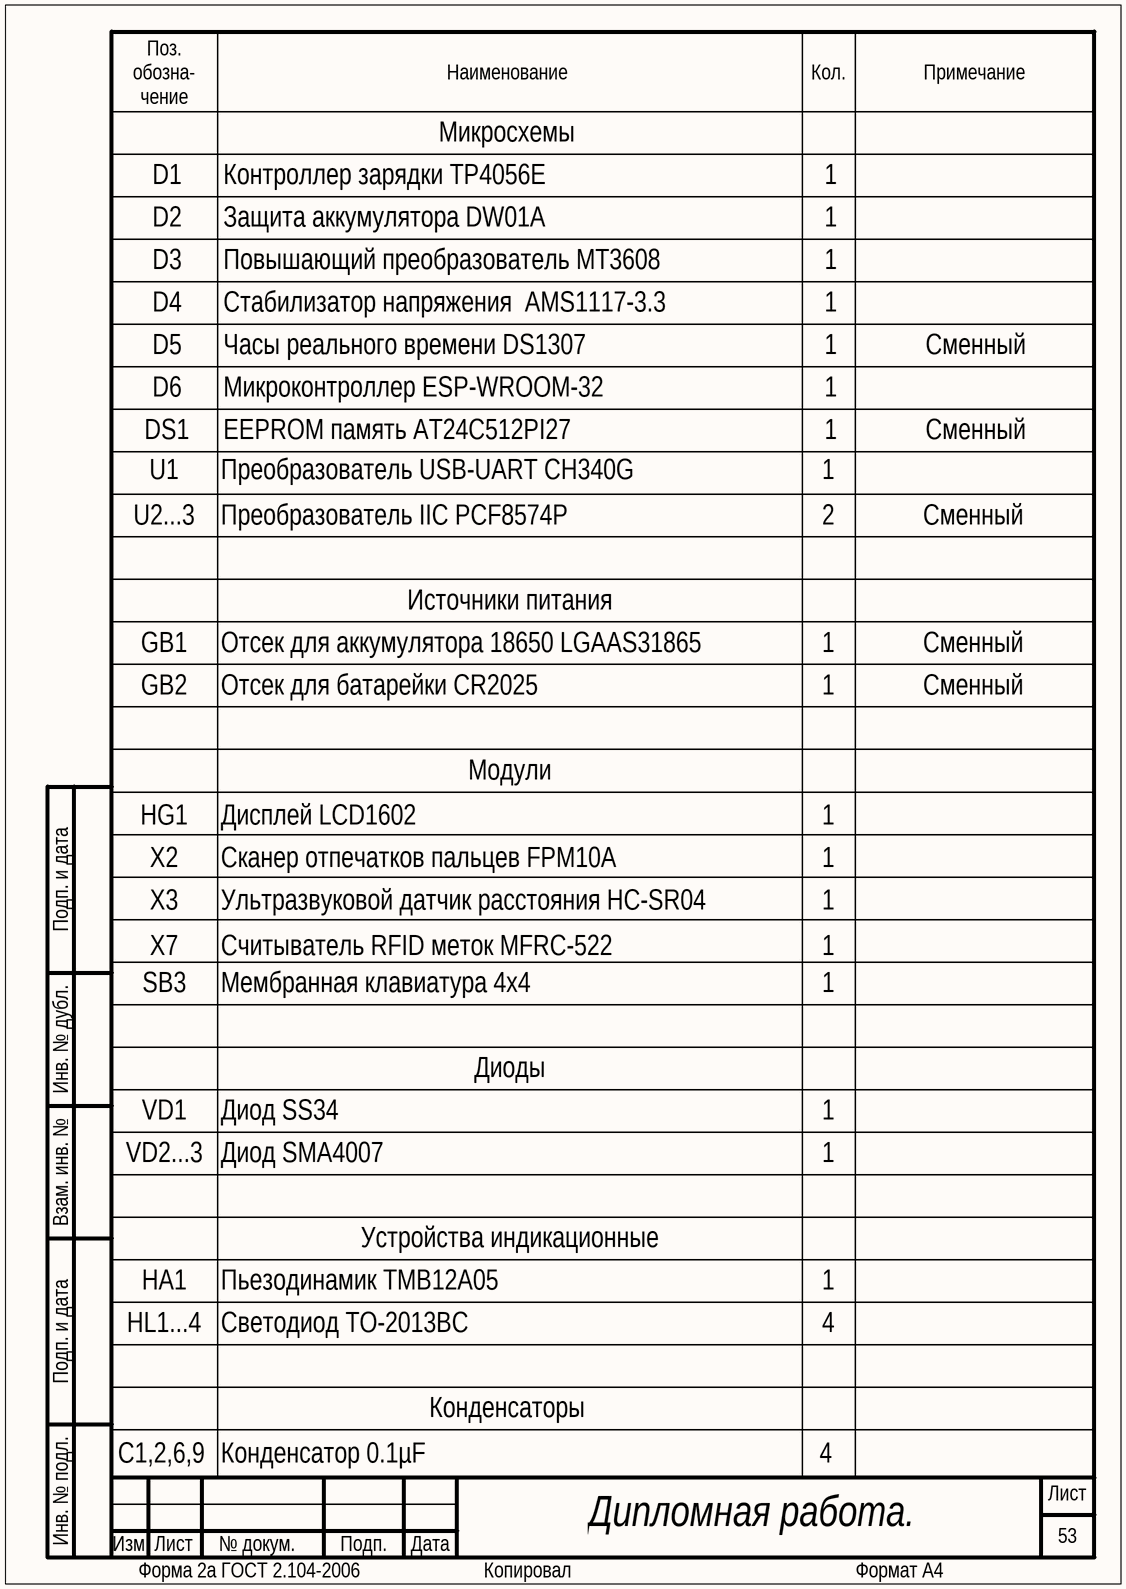
[diagram p3: Sheet4.SchDoc]

### Notes on the sheet
- D1
- Микросхемы
- Контроллер зарядки TP4056E
- 1
- D2
- Защита аккумулятора DW01A
- D3
- D4
- Повышающий преобразователь MT3608
- Стабилизатор напряжения  AMS1117-3.3
- D5
- Часы реального времени DS1307
- Сменный
- D6
- DS1
- Микроконтроллер ESP-WROOM-32
- EEPROM память AT24C512PI27
- U1
- U2...3
- Преобразователь USB-UART CH340G
- Преобразователь IIC PCF8574P
- 2
- GB1
- Источники питания
- Отсек для аккумулятора 18650 LGAAS31865
- GB2
- Отсек для батарейки CR2025
- Модули
- HG1
- Дисплей LCD1602
- X2
- X3
- Сканер отпечатков пальцев FPM10A
- Ультразвуковой датчик расстояния HC-SR04
- X7
- SB3
- Считыватель RFID меток MFRC-522
- Мембранная клавиатура 4x4
- VD1
- Диоды
- Диод SS34
- VD2...3
- Диод SMA4007
- Устройства индикационные
- HA1
- HL1...4
- Пьезодинамик TMB12A05
- Светодиод TO-2013BC
- 4
- С1,2,6,9
- Конденсаторы
- Конденсатор 0.1µF
- Дипломная работа.
- Поз.
  обозна-
  чение
- Наименование
- Кол.
- Примечание
- Подп. и дата
- Инв. № дубл.
- Взам. инв. №
- Инв. № подл.
- Изм.
- Лист
- № докум.
- Подп.
- Дата
- Форма 2а ГОСТ 2.104-2006
- Копировал
- Формат А4

## Sheet Sheet5.SchDoc: =GlobalProjectName
size 209 x 297 mm; ApprovedBy: Утвердил; CheckedBy: Проверил; Author: Разработал; SheetNumber: 54; SheetTotal: 66; PageSetup: Record=PageOptions|CenterHorizontal=True|CenterVertical=True|PrintScale=1.00|XCorrection=1.00|YCorrection=1.00|PrintKind=1|BorderSize=5000000|LeftOffset=0|BottomOffset=0|Orientation=2|PaperLength=1000|PaperWidth=1000|Scale=100|PaperSource=15|PrintQuality=1200|MediaType=1|DitherType=10|PaperKind=A3|PrintScaleMode=1; Weight: -; ScaleFactor: -; NormInspection: Норм.Контр.
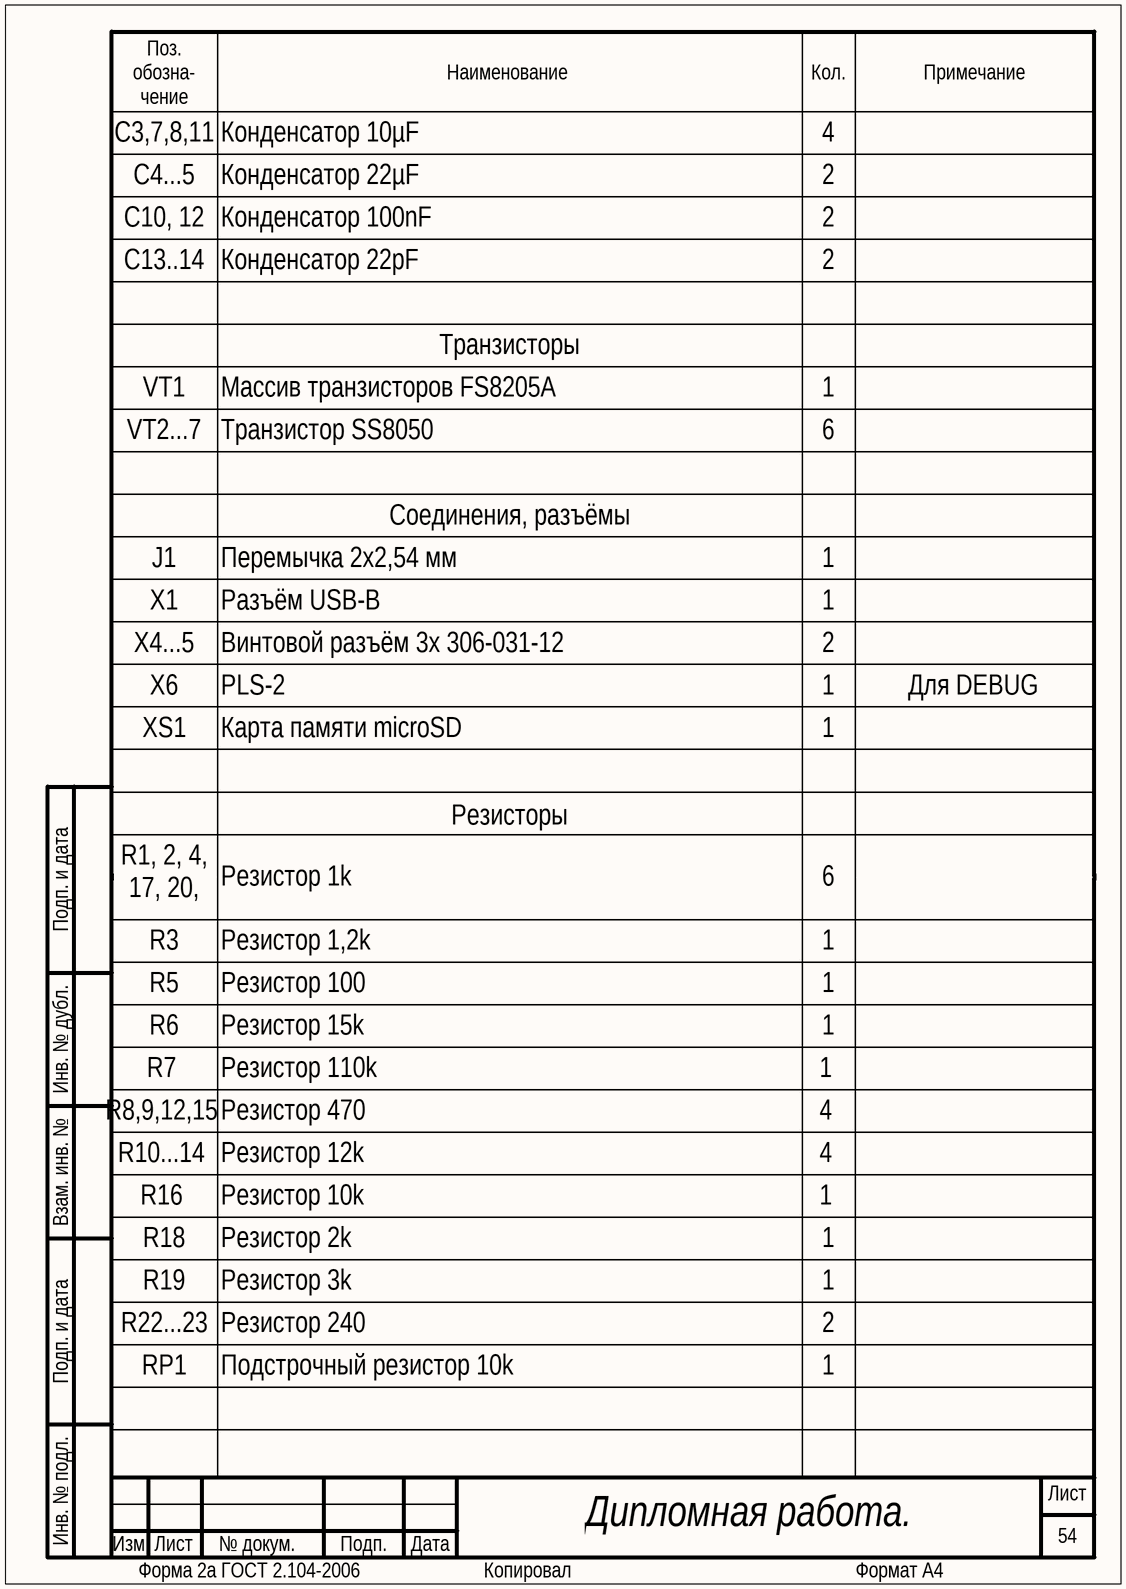
[diagram p4: Sheet5.SchDoc]

### Notes on the sheet
- С4...5
- С3,7,8,11
- Конденсатор 22µF
- Конденсатор 10µF
- 2
- 4
- С10, 12
- Конденсатор 100nF
- С13..14
- Конденсатор 22pF
- Транзисторы
- VT1
- VT2...7
- Массив транзисторов FS8205A
- Транзистор SS8050
- 1
- 6
- Соединения, разъёмы
- J1
- Перемычка 2x2,54 мм
- X1
- X4...5
- Разъём USB-B
- Винтовой разъём 3x 306-031-12
- X6
- PLS-2
- Для DEBUG
- XS1
- Карта памяти microSD
- Резисторы
- R1, 2, 4,  17, 20, 21
- Резистор 1k
- R3
- R5
- Резистор 1,2k
- Резистор 100
- R6
- Резистор 15k
- R7
- R8,9,12,15
- Резистор 110k
- Резистор 470
- R10...14
- Резистор 12k
- R16
- R18
- Резистор 10k
- Резистор 2k
- R19
- R22...23
- Резистор 3k
- Резистор 240
- RP1
- Подстрочный резистор 10k
- Дипломная работа.
- Поз.
  обозна-
  чение
- Наименование
- Кол.
- Примечание
- Подп. и дата
- Инв. № дубл.
- Взам. инв. №
- Инв. № подл.
- Изм.
- Лист
- № докум.
- Подп.
- Дата
- Форма 2а ГОСТ 2.104-2006
- Копировал
- Формат А4

## Sheet Sheet6.SchDoc: =GlobalProjectName
size 209 x 297 mm; ApprovedBy: Утвердил; CheckedBy: Проверил; Author: Разработал; SheetNumber: 55; SheetTotal: 66; PageSetup: Record=PageOptions|CenterHorizontal=True|CenterVertical=True|PrintScale=1.00|XCorrection=1.00|YCorrection=1.00|PrintKind=1|BorderSize=5000000|LeftOffset=0|BottomOffset=0|Orientation=2|PaperLength=1000|PaperWidth=1000|Scale=100|PaperSource=15|PrintQuality=1200|MediaType=1|DitherType=10|PaperKind=A3|PrintScaleMode=1; Weight: -; ScaleFactor: -; NormInspection: Норм.Контр.
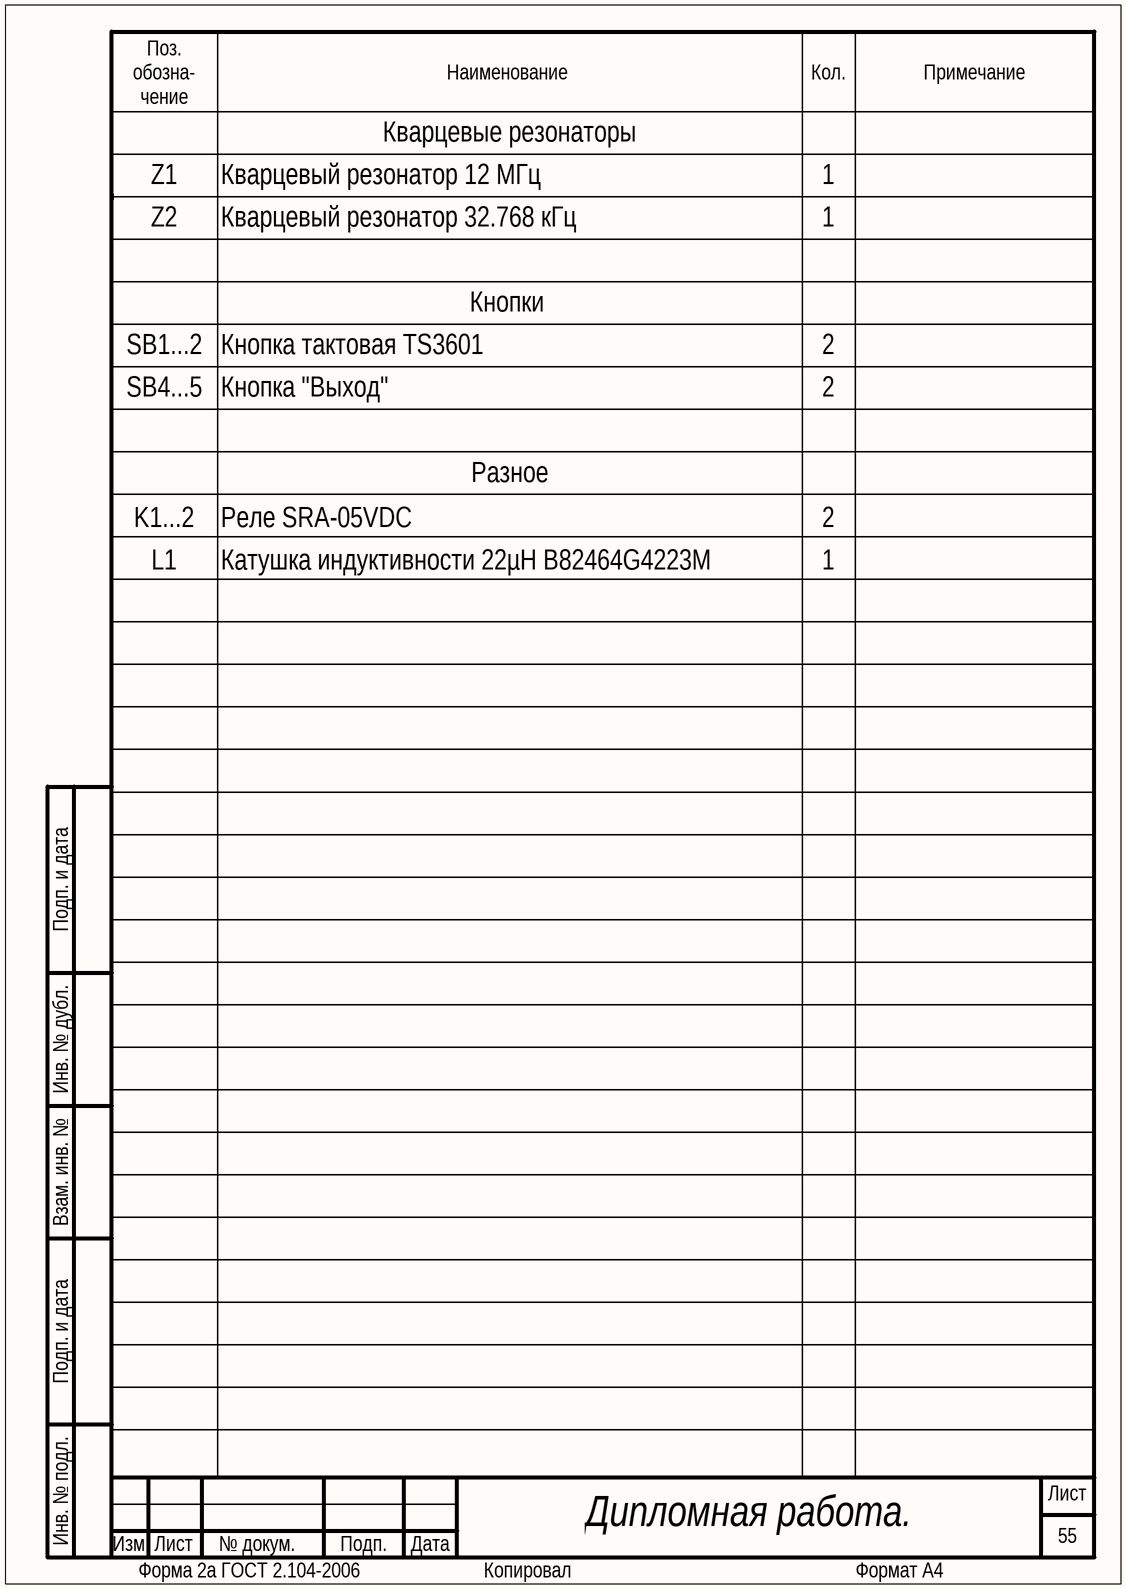
[diagram p5: Sheet6.SchDoc]

### Notes on the sheet
- Z1
- Кварцевые резонаторы
- Кварцевый резонатор 12 МГц
- 1
- Z2
- Кварцевый резонатор 32.768 кГц
- Кнопки
- SB1...2
- Кнопка тактовая TS3601
- 2
- SB4...5
- Кнопка "Выход"
- K1...2
- Разное
- Реле SRA-05VDC
- L1
- Катушка индуктивности 22µH B82464G4223M
- Дипломная работа.
- Поз.
  обозна-
  чение
- Наименование
- Кол.
- Примечание
- Подп. и дата
- Инв. № дубл.
- Взам. инв. №
- Инв. № подл.
- Изм.
- Лист
- № докум.
- Подп.
- Дата
- Форма 2а ГОСТ 2.104-2006
- Копировал
- Формат А4

## Nets that join several sheets
+3.3: Sheet1 (6 pins), Sheet2 (5 pins), Sheet3 (D6.2 X7.8)
+5: Sheet1 (8 pins), Sheet2 (10 pins), Sheet3 (7 pins)
GND: Sheet1 (22 pins), Sheet2 (22 pins), Sheet3 (12 pins)
NetD5_5: Sheet2 (D5.5 DS1.5 U2.15), Sheet3 (D6.33 R25.2 U3.15)
NetD5_6: Sheet2 (D5.6 DS1.6 U2.14), Sheet3 (D6.36 R26.2 U3.14)
NetD6_3: Sheet2 (R14.1 R15.1 VT2.3), Sheet3 (D6.3)
NetD6_10: Sheet2 (R21.1), Sheet3 (D6.10)
NetD6_11: Sheet2 (R20.1), Sheet3 (D6.11)
NetD6_14: Sheet2 (SB5.1), Sheet3 (D6.14)
NetD6_16: Sheet2 (SB4.1), Sheet3 (D6.16)
NetD6_23: Sheet1 (VT4.1), Sheet3 (D6.23)
NetD6_25: Sheet2 (R12.1 R13.1 VT3.3), Sheet3 (D6.25)
NetD6_26: Sheet1 (R18.1 R19.2), Sheet3 (D6.26)
NetD6_27: Sheet1 (X2.3), Sheet3 (D6.27)
NetD6_28: Sheet1 (X2.2), Sheet3 (D6.28)
NetD6_29: Sheet1 (XS1.2), Sheet3 (D6.29)
NetD6_30: Sheet1 (XS1.5), Sheet3 (D6.30 X7.2)
NetD6_31: Sheet1 (XS1.7), Sheet3 (D6.31 X7.4)
NetD6_34: Sheet2 (HL5.2), Sheet3 (D6.34 X6.1)
NetD6_35: Sheet2 (HL4.1), Sheet3 (D6.35 X6.2)
NetD6_37: Sheet1 (XS1.3), Sheet3 (D6.37 X7.3)
NetU1_5: Sheet1 (X1.3), Sheet2 (U1.5)
NetU1_6: Sheet1 (X1.2), Sheet2 (U1.6)